# EAGLE design ULN2003_DoubleStrip_ThinkerKit_v02 (EAGLE 5.09)
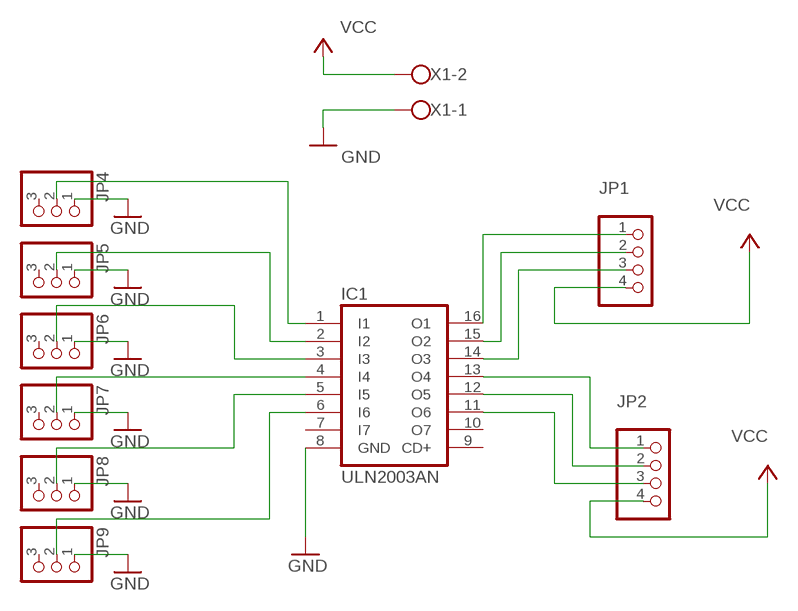
[diagram p0: schematic, sheet 1]

## Parts
IC1  ULN2003AN  [DIL16]
JP1  PINHD-1X4  [1X04]
JP2  PINHD-1X4  [1X04]
JP4  PINHD-1X3  [1X03]
JP5  PINHD-1X3  [1X03]
JP6  PINHD-1X3  [1X03]
JP7  PINHD-1X3  [1X03]
JP8  PINHD-1X3  [1X03]
JP9  PINHD-1X3  [1X03]
X1  W237-102  [W237-102]

## Nets
GND: IC1.8(GND) JP4.1 JP5.1 JP6.1 JP7.1 JP8.1 JP9.1 X1.1
N$1: IC1.13(O4) JP2.1
N$2: IC1.1(I1) JP4.2
N$3: IC1.2(I2) JP5.2
N$4: IC1.3(I3) JP6.2
N$5: IC1.4(I4) JP7.2
N$6: IC1.5(I5) JP8.2
N$7: IC1.6(I6) JP9.2
N$8: IC1.16(O1) JP1.1
N$9: IC1.15(O2) JP1.2
N$10: IC1.14(O3) JP1.3
N$11: IC1.12(O5) JP2.2
N$12: IC1.11(O6) JP2.3
VCC: JP1.4 JP2.4 X1.2
Unconnected: IC1.7(I7) IC1.9(CD+) IC1.10(O7) JP4.3 JP5.3 JP6.3 JP7.3 JP8.3 JP9.3

## Library data of the parts
IC1 = uln-udn:ULN2003A: DRIVER ARRAY
JP1 JP2 = pinhead:PINHD-1X4: PIN HEADER
JP4-JP9 = pinhead:PINHD-1X3: PIN HEADER
X1 = con-wago-500:W237-102: WAGO SCREW CLAMP

## Board
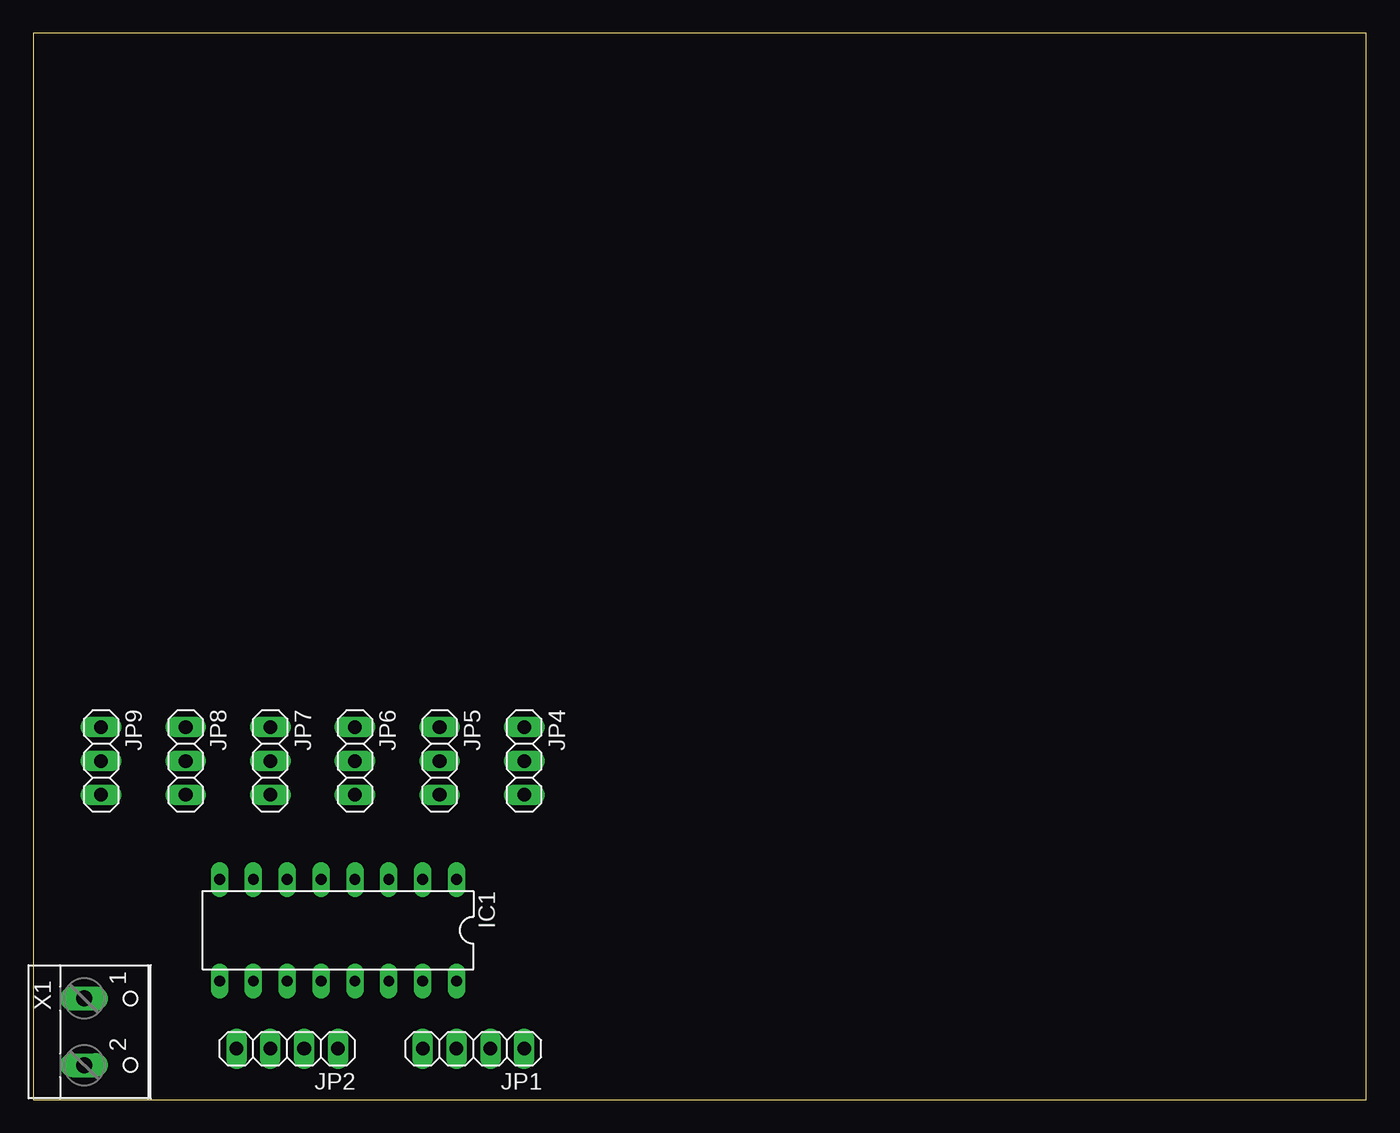
[diagram p1: board, top side]
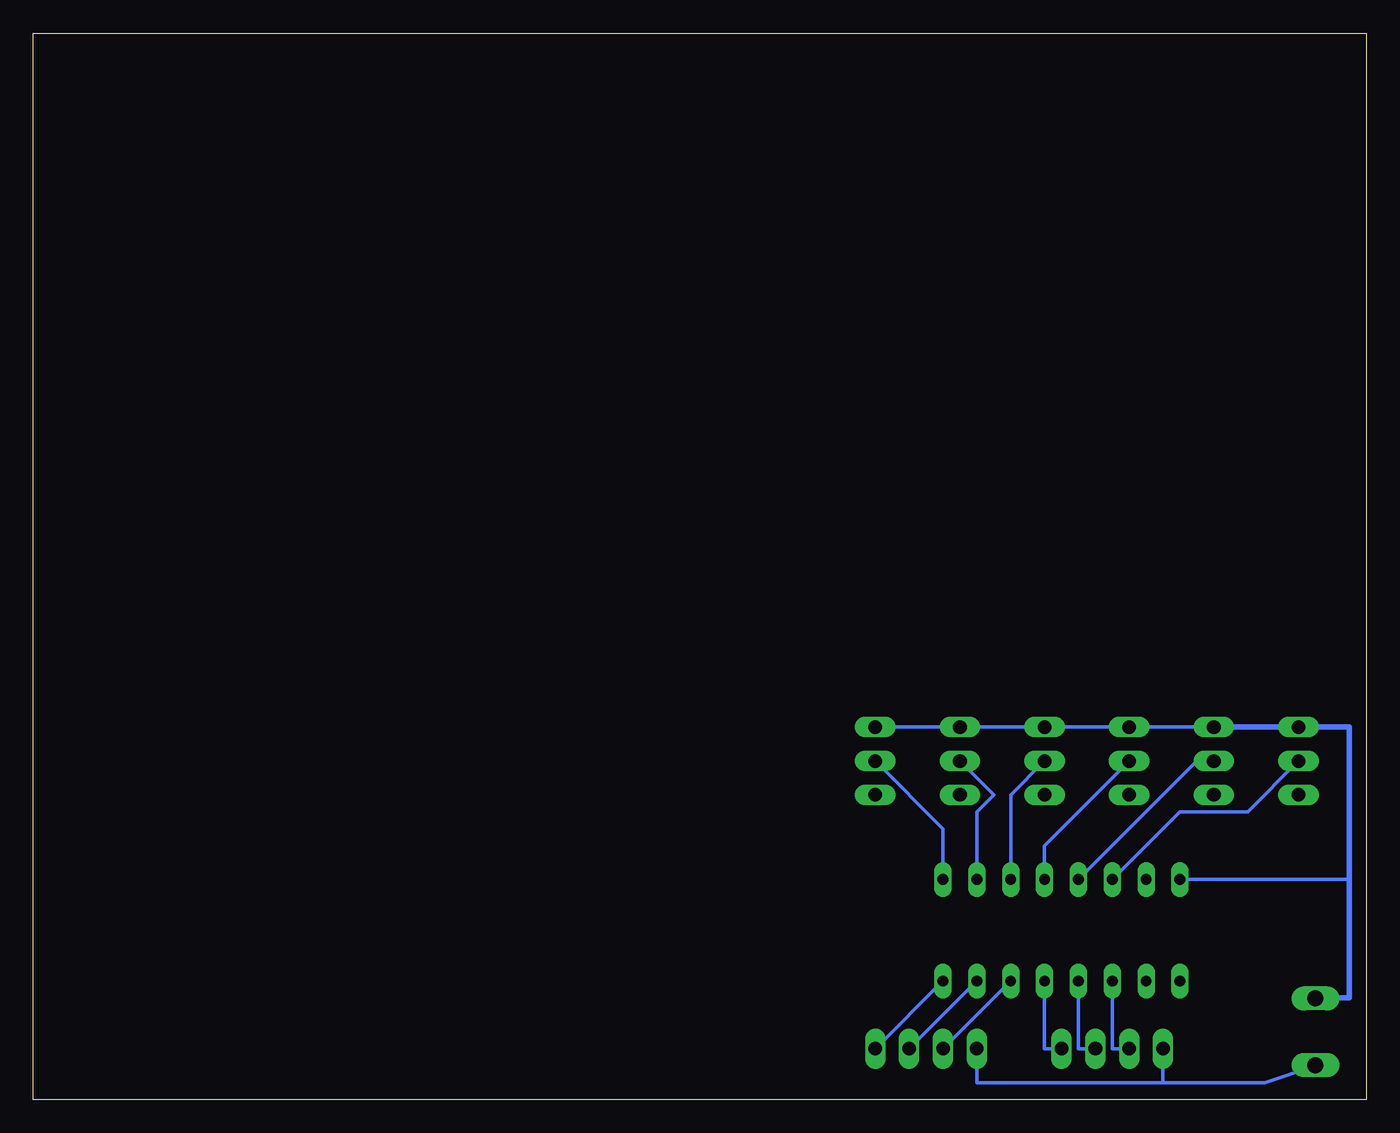
[diagram p2: board, bottom side, seen from below]

Size 100 x 80 mm. Coordinates in mm from the lower left corner, seen from the top.
Outline: 0,0 100,0 100,80 0,80 0,0
Copper layers (1*16): Top 0.035mm / dielectric 1.5mm / Bottom 0.035mm
Design rules "default": minimum track width 10mil, minimum drill 24mil, track to track 8mil, track to pad 8mil, pad to pad 8mil, via to via 8mil, smd to smd 8mil, copper to edge 40mil, drill to drill 8mil, minimum pad ring 10mil, minimum via ring 8mil, stop-mask expansion 4mil, vias tented up to drill 0mil, thermal gap 10mil

### Footprints (pad centres in the part's own frame; a part is rotated, then mirrored left to right if it is on the bottom)
DIL16 = drill 0.813 long: 1 -8.89,-3.81; 2 -6.35,-3.81; 3 -3.81,-3.81; 4 -1.27,-3.81; 5 1.27,-3.81; 6 3.81,-3.81; 7 6.35,-3.81; 8 8.89,-3.81; 9 8.89,3.81; 10 6.35,3.81; 11 3.81,3.81; 12 1.27,3.81; 13 -1.27,3.81; 14 -3.81,3.81; 15 -6.35,3.81; 16 -8.89,3.81
1X04 = drill 1.016 long: 1 -3.81,0; 2 -1.27,0; 3 1.27,0; 4 3.81,0
1X03 = drill 1.016 long: 1 -2.54,0; 2 0,0; 3 2.54,0
W237-102 = drill 1.194 long: 1 -2.5,-1.27; 2 2.5,-1.27

### Placement (x,y rotation side)
IC1  22.86,12.7 180 top
JP1  33.02,3.81 180 top
JP2  19.05,3.81 180 top
JP4  36.83,25.4 270 top
JP5  30.48,25.4 270 top
JP6  24.13,25.4 270 top
JP7  17.78,25.4 270 top
JP8  11.43,25.4 270 top
JP9  5.08,25.4 270 top
X1  5.08,5.08 270 top

### Tracks (layer width: path | path; a pad name or v marks a point on that pad's centre or on a via)
GND
  Bottom 0.254: 1.27,16.51 IC1.8 | 2.54,7.62 3.81,7.62 X1.1 | JP8.1 JP7.1 JP6.1 JP5.1 JP4.1 | JP9.1 6.35,27.94
  Bottom 0.406: JP9.1 1.27,27.94 1.27,16.51 1.27,7.62 2.54,7.62 | 6.35,27.94 JP8.1
N$1
  Bottom 0.254: IC1.13 24.13,3.81 JP2.1
N$2
  Bottom 0.254: IC1.1 31.75,20.32 JP4.2
N$3
  Bottom 0.254: IC1.2 29.21,21.59 27.94,22.86 JP5.2
N$4
  Bottom 0.254: IC1.3 26.67,22.86 JP6.2
N$5
  Bottom 0.254: IC1.4 24.13,19.05 JP7.2
N$6
  Bottom 0.254: IC1.5 12.7,25.4 JP8.2
N$7
  Bottom 0.254: IC1.6 13.97,21.59 8.89,21.59 JP9.2
N$8
  Bottom 0.254: JP1.1 IC1.16
N$9
  Bottom 0.254: JP1.2 IC1.15
N$10
  Bottom 0.254: JP1.3 IC1.14
N$11
  Bottom 0.254: IC1.12 21.59,3.81 JP2.2
N$12
  Bottom 0.254: IC1.11 19.05,3.81 JP2.3
VCC
  Bottom 0.254: 15.24,1.27 7.62,1.27 3.81,2.54 X1.2 | 15.24,1.27 JP2.4 | JP1.4 29.21,1.27 15.24,1.27